# EAGLE schematic leaf_type_00 (EAGLE 7.6.0)
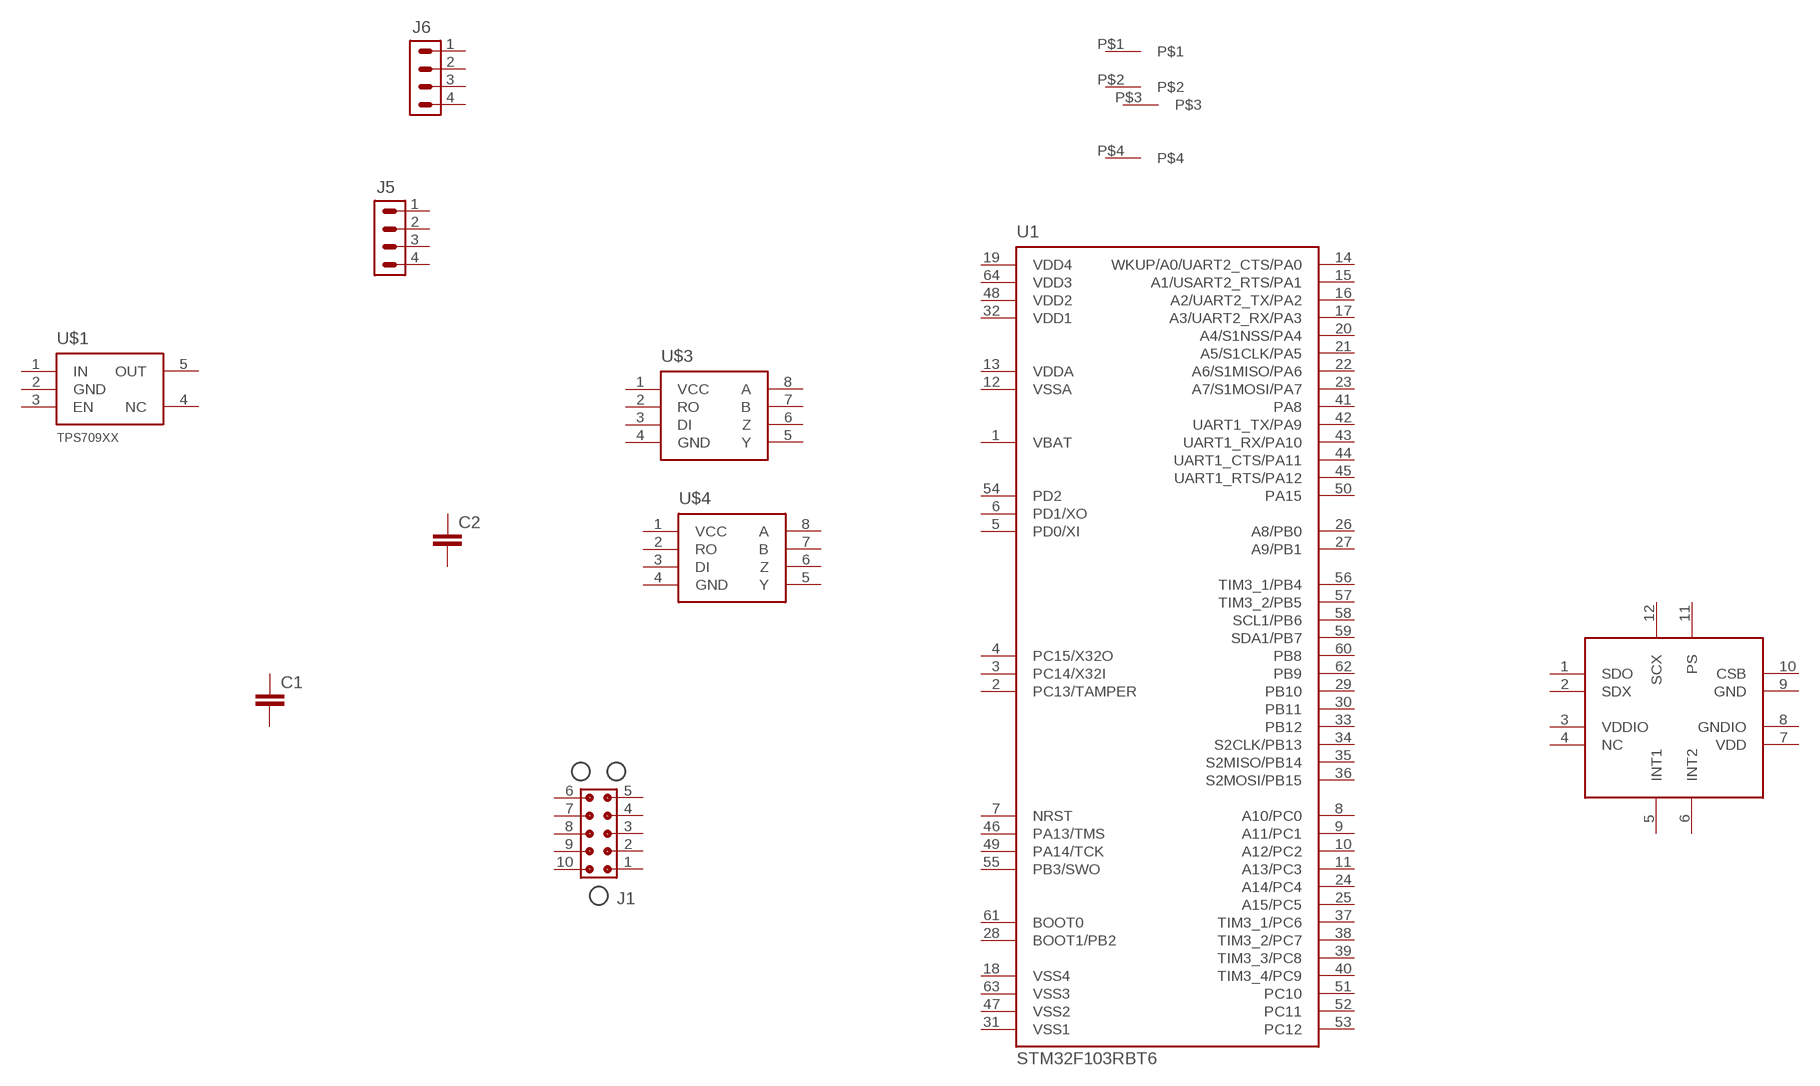
[diagram p0: schematic, sheet 1]

## Parts
C1  0805_CAP  [0805]
C2  0805_CAP  [0805]
J1  TC_2050_IDC_NL_TOP  [TC_2050_IDC_NL_TOP]
J5  CONN_04_JST_PA  [CONN_04_JST_PA]
J6  CONN_04_JST_PA  [CONN_04_JST_PA]
U1  STM32F103RBT6  [STM32_TQFP_64_10X10]
U$1  TPS709XX  [SOT23-5]
U$2  BMA280  [BMA280]
U$3  RS422_TRANSCEIVER_ISL83488  [SO-08]
U$4  RS422_TRANSCEIVER_ISL83488  [SO-08]
U$5  BMI-S-103  [BMI-S-103]
Unconnected: C1.P$1 C1.P$2 C2.P$1 C2.P$2 J1.1 J1.2 J1.3 J1.4 J1.5 J1.6 J1.7 J1.8 J1.9 J1.10 J5.1 J5.2 J5.3 J5.4 J6.1 J6.2 J6.3 J6.4 U1.1(VBAT) U1.2(PC13/TAMPER) U1.3(PC14/X32I) U1.4(PC15/X32O) U1.5(PD0/XI) U1.6(PD1/XO) U1.7(NRST) U1.8(A10/PC0) U1.9(A11/PC1) U1.10(A12/PC2) U1.11(A13/PC3) U1.12(VSSA) U1.13(VDDA) U1.14(WKUP/A0/UART2_CTS/PA0) U1.15(A1/USART2_RTS/PA1) U1.16(A2/UART2_TX/PA2) U1.17(A3/UART2_RX/PA3) U1.18(VSS4) U1.19(VDD4) U1.20(A4/S1NSS/PA4) U1.21(A5/S1CLK/PA5) U1.22(A6/S1MISO/PA6) U1.23(A7/S1MOSI/PA7) U1.24(A14/PC4) U1.25(A15/PC5) U1.26(A8/PB0) U1.27(A9/PB1) U1.28(BOOT1/PB2) U1.29(PB10) U1.30(PB11) U1.31(VSS1) U1.32(VDD1) U1.33(PB12) U1.34(S2CLK/PB13) U1.35(S2MISO/PB14) U1.36(S2MOSI/PB15) U1.37(TIM3_1/PC6) U1.38(TIM3_2/PC7) U1.39(TIM3_3/PC8) U1.40(TIM3_4/PC9) U1.41(PA8) U1.42(UART1_TX/PA9) U1.43(UART1_RX/PA10) U1.44(UART1_CTS/PA11) U1.45(UART1_RTS/PA12) U1.46(PA13/TMS) U1.47(VSS2) U1.48(VDD2) U1.49(PA14/TCK) U1.50(PA15) U1.51(PC10) U1.52(PC11) U1.53(PC12) U1.54(PD2) U1.55(PB3/SWO) U1.56(TIM3_1/PB4) U1.57(TIM3_2/PB5) U1.58(SCL1/PB6) U1.59(SDA1/PB7) U1.60(PB8) U1.61(BOOT0) U1.62(PB9) U1.63(VSS3) U1.64(VDD3) U$1.1(IN) U$1.2(GND) U$1.3(EN) U$1.4(NC) U$1.5(OUT) U$2.1(SDO) U$2.2(SDX) U$2.3(VDDIO) U$2.4(NC) U$2.5(INT1) U$2.6(INT2) U$2.7(VDD) U$2.8(GNDIO) U$2.9(GND) U$2.10(CSB) U$2.11(PS) U$2.12(SCX) U$3.1(VCC) U$3.2(RO) U$3.3(DI) U$3.4(GND) U$3.5(Y) U$3.6(Z) U$3.7(B) U$3.8(A) U$4.1(VCC) U$4.2(RO) U$4.3(DI) U$4.4(GND) U$4.5(Y) U$4.6(Z) U$4.7(B) U$4.8(A) U$5.P$1 U$5.P$2 U$5.P$3 U$5.P$4

## Library data of the parts
C1 C2 = stepOSP:0805_CAP
J1 = leaf:TC_2050_IDC_NL_TOP
J5 J6 = leaf:CONN_04_JST_PA
U1 = leaf:STM32F103RBT6
U$1 = stepOSP:TPS709XX
U$2 = stepOSP:BMA280
U$3 U$4 = stepOSP:RS422_TRANSCEIVER_ISL83488
U$5 = stepOSP:BMI-S-103